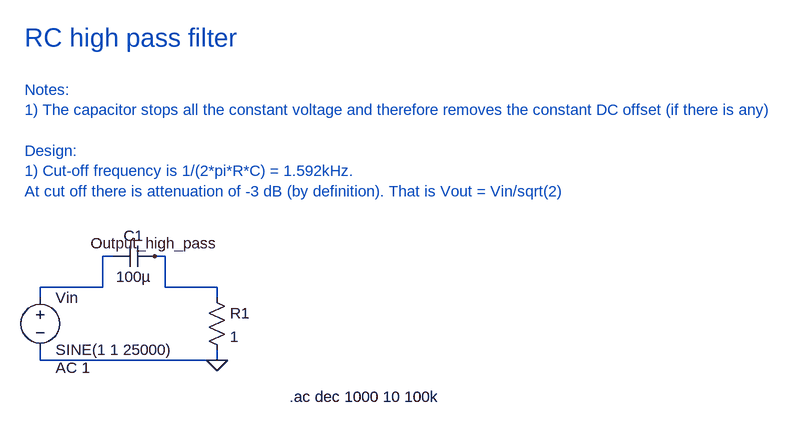
[diagram p0: schematic RC-highpass-frequency-domain.asc]
RC-highpass-frequency-domain.asc, the LTspice schematic file:
Version 4.1
SHEET 1 1284 680
WIRE 352 192 352 208
WIRE 80 192 80 208
WIRE 352 208 80 208
FLAG 352 208 0
WIRE 192 48 176 48
WIRE 80 112 80 96
WIRE 176 48 176 96
WIRE 176 96 80 96
WIRE 256 48 272 48
WIRE 352 112 352 96
WIRE 272 48 272 96
WIRE 272 96 352 96
FLAG 256 48 Output_high_pass
IOPIN 464 48 Out
SYMBOL voltage 80 96 R0
WINDOW 123 24 124 Left 2
WINDOW 39 0 0 Left 2
SYMATTR Value2 AC 1
SYMATTR InstName Vin
SYMATTR Value SINE(1 1 25000)
SYMBOL res 336 96 R0
SYMATTR InstName R1
SYMATTR Value 1
SYMBOL cap 192 64 R270
WINDOW 0 32 32 VTop 2
WINDOW 3 0 32 VBottom 2
SYMATTR InstName C1
SYMATTR Value 100µ
TEXT 464 264 Left 2 !.ac dec 1000 10 100k
TEXT 56 -208 Left 2 ;Notes:\n1) The capacitor stops all the constant voltage and therefore removes the constant DC offset (if there is any)\n \nDesign:\n1) Cut-off frequency is 1/(2*pi*R*C) = 1.592kHz.\nAt cut off there is attenuation of -3 dB (by definition). That is Vout = Vin/sqrt(2)
TEXT 56 -288 Left 4 ;RC high pass filter

The netlist it stands for:
* RC-highpass-frequency-domain.asc
Vin N001 0 SINE(1 1 25000) AC 1
R1 Output_high_pass 0 1
C1 N001 Output_high_pass 100µ
.ac dec 1000 10 100k
* Notes:
* 1) The capacitor stops all the constant voltage and therefore removes the constant DC offset (if there is any)
* Design:
* 1) Cut-off frequency is 1/(2*pi*R*C) = 1.592kHz.
* At cut off there is attenuation of -3 dB (by definition). That is Vout = Vin/sqrt(2)
* RC high pass filter
.backanno
.end